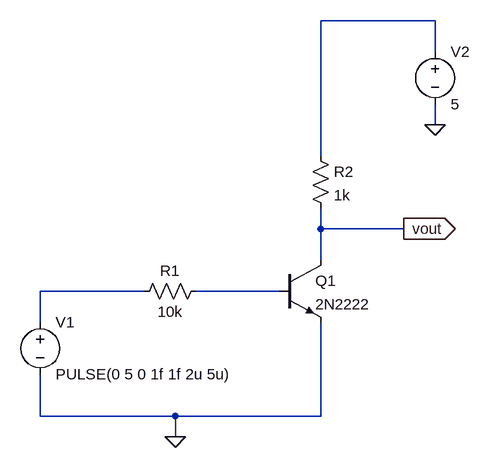
[diagram p0: schematic 2_Zadatak_Lab6.asc]
2_Zadatak_Lab6.asc, the LTspice schematic file:
Version 4
SHEET 1 880 680
WIRE 624 -320 448 -320
WIRE 624 -272 624 -320
WIRE 624 -160 624 -192
WIRE 448 -112 448 -320
WIRE 448 0 448 -32
WIRE 576 0 448 0
WIRE 448 48 448 0
WIRE 176 96 16 96
WIRE 384 96 256 96
WIRE 16 144 16 96
WIRE 16 288 16 224
WIRE 224 288 16 288
WIRE 448 288 448 144
WIRE 448 288 224 288
WIRE 224 320 224 288
FLAG 224 320 0
FLAG 576 0 vout
IOPIN 576 0 Out
FLAG 624 -160 0
SYMBOL voltage 16 128 R0
WINDOW 123 0 0 Left 0
WINDOW 39 0 0 Left 0
SYMATTR InstName V1
SYMATTR Value PULSE(0 5 0 1f 1f 2u 5u)
SYMBOL res 272 80 R90
WINDOW 0 0 56 VBottom 2
WINDOW 3 32 56 VTop 2
SYMATTR InstName R1
SYMATTR Value 10k
SYMBOL npn 384 48 R0
SYMATTR InstName Q1
SYMATTR Value 2N2222
SYMBOL res 432 -128 R0
SYMATTR InstName R2
SYMATTR Value 1k
SYMBOL voltage 624 -288 R0
SYMATTR InstName V2
SYMATTR Value 5

The netlist it stands for:
* 2_Zadatak_Lab6.asc
V1 N002 0 PULSE(0 5 0 1f 1f 2u 5u)
R1 N003 N002 10k
Q1 vout N003 0 0 2N2222
R2 N001 vout 1k
V2 N001 0 5
.model NPN NPN
.model PNP PNP
.lib standard.bjt
.backanno
.end